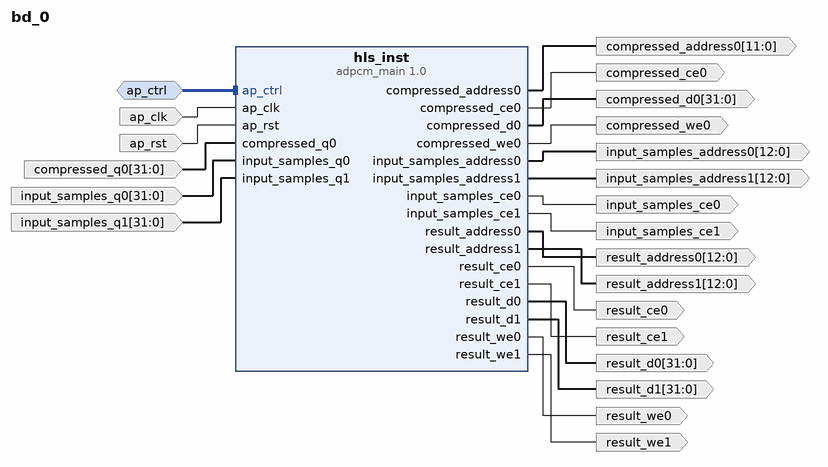
[diagram p0: block diagram of the top level]
# Vivado block design bd_0, xc7z020clg400-1, Vivado 2023.2
create_bd_design bd_0

create_bd_intf_port -mode Slave -vlnv xilinx.com:interface:acc_handshake_rtl:1.0 ap_ctrl
create_bd_port -dir I -type clk ap_clk
set_property -dict {CONFIG.FREQ_HZ 200000000.0} [get_bd_ports ap_clk]
create_bd_port -dir I -type rst ap_rst
set_property -dict {CONFIG.POLARITY ACTIVE_HIGH} [get_bd_ports ap_rst]
create_bd_port -dir O -from 11 -to 0 -type data compressed_address0
create_bd_port -dir O compressed_ce0
create_bd_port -dir O -from 31 -to 0 -type data compressed_d0
create_bd_port -dir I -from 31 -to 0 -type data compressed_q0
create_bd_port -dir O compressed_we0
create_bd_port -dir O -from 12 -to 0 -type data input_samples_address0
create_bd_port -dir O -from 12 -to 0 -type data input_samples_address1
create_bd_port -dir O input_samples_ce0
create_bd_port -dir O input_samples_ce1
create_bd_port -dir I -from 31 -to 0 -type data input_samples_q0
create_bd_port -dir I -from 31 -to 0 -type data input_samples_q1
create_bd_port -dir O -from 12 -to 0 -type data result_address0
create_bd_port -dir O -from 12 -to 0 -type data result_address1
create_bd_port -dir O result_ce0
create_bd_port -dir O result_ce1
create_bd_port -dir O -from 31 -to 0 -type data result_d0
create_bd_port -dir O -from 31 -to 0 -type data result_d1
create_bd_port -dir O result_we0
create_bd_port -dir O result_we1

create_bd_cell -type ip -vlnv xilinx.com:hls:adpcm_main:1.0 hls_inst

# ---- connections ----

connect_bd_intf_net -intf_net ap_ctrl_0_1 [get_bd_intf_ports ap_ctrl] [get_bd_intf_pins hls_inst/ap_ctrl]
connect_bd_net -net ap_clk_0_1 [get_bd_ports ap_clk] [get_bd_pins hls_inst/ap_clk]
connect_bd_net -net ap_rst_0_1 [get_bd_ports ap_rst] [get_bd_pins hls_inst/ap_rst]
connect_bd_net -net compressed_q0_0_1 [get_bd_ports compressed_q0] [get_bd_pins hls_inst/compressed_q0]
connect_bd_net [get_bd_pins hls_inst/compressed_address0] [get_bd_ports compressed_address0]
connect_bd_net [get_bd_pins hls_inst/compressed_ce0] [get_bd_ports compressed_ce0]
connect_bd_net [get_bd_pins hls_inst/compressed_d0] [get_bd_ports compressed_d0]
connect_bd_net [get_bd_pins hls_inst/compressed_we0] [get_bd_ports compressed_we0]
connect_bd_net [get_bd_pins hls_inst/input_samples_address0] [get_bd_ports input_samples_address0]
connect_bd_net [get_bd_pins hls_inst/input_samples_address1] [get_bd_ports input_samples_address1]
connect_bd_net [get_bd_pins hls_inst/input_samples_ce0] [get_bd_ports input_samples_ce0]
connect_bd_net [get_bd_pins hls_inst/input_samples_ce1] [get_bd_ports input_samples_ce1]
connect_bd_net [get_bd_pins hls_inst/result_address0] [get_bd_ports result_address0]
connect_bd_net [get_bd_pins hls_inst/result_address1] [get_bd_ports result_address1]
connect_bd_net [get_bd_pins hls_inst/result_ce0] [get_bd_ports result_ce0]
connect_bd_net [get_bd_pins hls_inst/result_ce1] [get_bd_ports result_ce1]
connect_bd_net [get_bd_pins hls_inst/result_d0] [get_bd_ports result_d0]
connect_bd_net [get_bd_pins hls_inst/result_d1] [get_bd_ports result_d1]
connect_bd_net [get_bd_pins hls_inst/result_we0] [get_bd_ports result_we0]
connect_bd_net [get_bd_pins hls_inst/result_we1] [get_bd_ports result_we1]
connect_bd_net -net input_samples_q0_0_1 [get_bd_ports input_samples_q0] [get_bd_pins hls_inst/input_samples_q0]
connect_bd_net -net input_samples_q1_0_1 [get_bd_ports input_samples_q1] [get_bd_pins hls_inst/input_samples_q1]

validate_bd_design
save_bd_design
